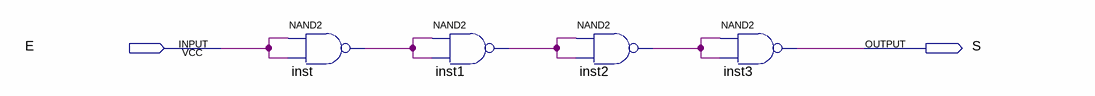
[diagram p0: schematic sheet]
// Quartus schematic circuitoFigura1.bdf as structural Verilog: 4 symbols, 2 pins
module circuitoFigura1 (
  input  E,
  output S
);

  wire inst1_out, inst2_out, inst_out;

  nand inst (inst_out, E, E);
  nand inst1 (inst1_out, inst_out, inst_out);
  nand inst2 (inst2_out, inst1_out, inst1_out);
  nand inst3 (S, inst2_out, inst2_out);
endmodule
